# EAGLE design PICKIT4-adaptor-SWDOnly (EAGLE 7.7.0)
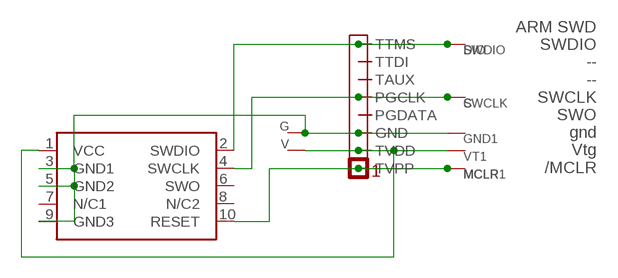
[diagram p0: schematic, sheet 1]

## Parts
C  WIRE-R12  [VIA12]
DIO  WIRE-R12  [VIA12]
G  WIRE-R12  [VIA12]
GND1  WIRE-R12  [VIA12]
MCLR  WIRE-R12  [VIA12]
MCLR1  WIRE-R12  [VIA12]
SWCLK  WIRE-R12  [VIA12]
SWD1  CORTEX_SWD  [M50-3600542]
SWDIO  WIRE-R12  [VIA12]
U$1  PICKIT4PINHDR  [PINHEAD1X8]
V  WIRE-R12  [VIA12]
VT1  WIRE-R12  [VIA12]

## Nets
GND: G.P$1 GND1.P$1 SWD1.3(GND1) SWD1.5(GND2) SWD1.9(GND3) U$1.P$3(GND)
N$2: SWD1.1(VCC) U$1.P$2(TVDD) V.P$1 VT1.P$1
N$5: C.P$1 SWCLK.P$1 SWD1.4(SWCLK) U$1.P$5(PGCLK)
N$9: MCLR1.P$1 MCLR.P$1 SWD1.10(RESET) U$1.P$1(TVPP)
TTMS: DIO.P$1 SWD1.2(SWDIO) SWDIO.P$1 U$1.P$8(TTMS)
Unconnected: SWD1.6(SWO) SWD1.7(N/C1) SWD1.8(N/C2) U$1.P$4(PGDATA) U$1.P$6(TAUX) U$1.P$7(TTDI)

## Library data of the parts
C DIO G GND1 MCLR MCLR1 SWCLK SWDIO V VT1 = mylib4:WIRE: Pad for a wire offboard
SWD1 = carrilib:CORTEX_SWD: .05" Cortex M Connector in SWD mode Manufacturer: Generic Part Number: Cortex M SWD Notes: I use Harwin M50-3600542 connectors
U$1 = mylib4:PICKIT4: PICKIT 4 Programming connector Handles PICx, ARM SWD, AVR ISP, UPDI, PDI, TPI, an JTAG/EJTAG

## Net classes
0 default: width 0.4 mm, drill 0.6 mm, clearance 0.152 mm
1 power: width 0.8 mm, drill 0.7 mm, clearance 0.152 mm
2 clock: width 0.25 mm, drill 0.6 mm, clearance 0.152 mm

## Board
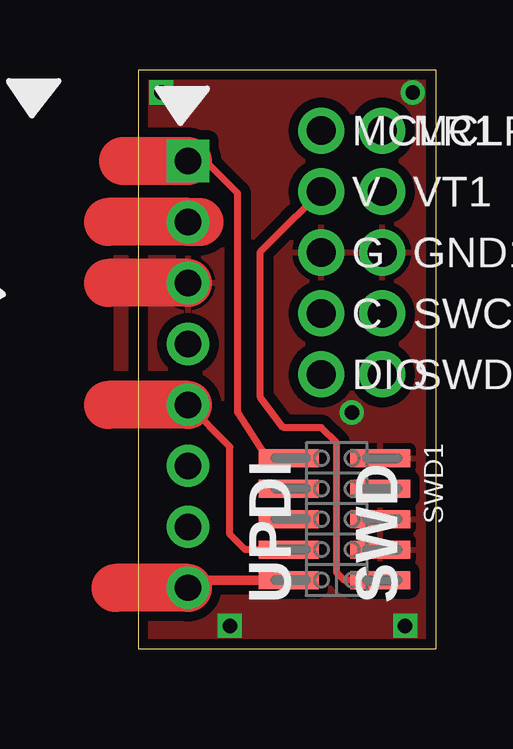
[diagram p1: board, top side]
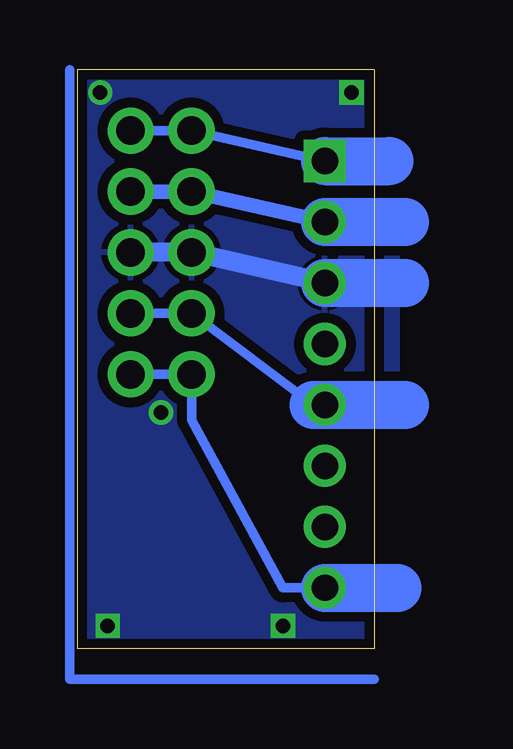
[diagram p2: board, bottom side, seen from below]

Size 12.38 x 24.13 mm. Coordinates in mm from the lower left corner, seen from the top.
Outline: 0,0 12.38,0 12.38,24.13 0,24.13 0,0
Copper layers (1*16): Top 0.035mm / dielectric 1.5mm / Bottom 0.035mm
Design rules "default *": minimum track width 10mil, minimum drill 24mil, track to track 6mil, track to pad 6mil, pad to pad 8mil, via to via 8mil, smd to smd 8mil, copper to edge 16mil, drill to drill 8mil, minimum pad ring 10mil, minimum via ring 8mil, stop-mask expansion 4mil, vias tented up to drill 0.65mm, thermal gap 10mil

### Footprints (pad centres in the part's own frame; a part is rotated, then mirrored left to right if it is on the bottom)
VIA12 = drill 1.2: P$1 0,0
M50-3600542 = smd 0.75 x 2.5: 1 -2.54,-1.81; 2 -2.54,2; 3 -1.27,-1.81; 4 -1.27,2; 5 0,-1.81; 6 0,2; 7 1.27,-1.81; 8 1.27,2; 9 2.54,-1.81; 10 2.54,2
PINHEAD1X8 = drill 1.1 square: P$1 0,8.89 | drill 1.1: P$2 0,6.35; P$3 0,3.81; P$4 0,1.27; P$5 0,-1.27; P$6 0,-3.81; P$7 0,-6.35; P$8 0,-8.89

### Placement (x,y rotation side)
C  7.62,13.97 0 top
DIO  7.62,11.43 0 top
G  7.62,16.51 0 top
GND1  10.16,16.51 0 top
MCLR  10.16,21.59 0 top
MCLR1  7.62,21.59 0 top
SWCLK  10.16,13.97 0 top
SWD1  8.26,5.4 90 top
SWDIO  10.16,11.43 0 top
U$1  2.06,11.43 0 top
V  7.62,19.05 0 top
VT1  10.16,19.05 0 top

### Tracks (layer width: path | path; a pad name or v marks a point on that pad's centre or on a via)
GND  (via drill 0.6)
  Top 2: U$1.P$3 -1.27,15.24
  Bottom 0.8: U$1.P$3 G.P$1 GND1.P$1
  Bottom 2: U$1.P$3 -1.27,15.24
  other vias: 0.95,23.18 11.43,23.18 11.11,0.95 3.81,0.95 8.89,9.84
  pour Top (isolate 0.4): -0.95,24.77 -0.95,-2.22 13.02,-2.22 13.02,24.77
  pour Bottom (isolate 0.4): -0.95,25.16 -0.95,-1.91 12.78,-1.98 12.78,25.32
N$1
  Bottom 0.4: 0,-1.27 12.7,-1.27 12.7,24.13
N$2
  Top 0.3: SWD1.1 8.57,2.86 8.26,3.18 8.26,8.57 7.62,9.21 6.03,9.21 5.08,10.48 5.08,16.54 6.34,17.81 7.33,18.76 V.P$1
  Top 2: 2.54,17.78 U$1.P$2 -1.27,17.78
  Bottom 0.6: U$1.P$2 V.P$1 VT1.P$1
  Bottom 2: U$1.P$2 -1.27,17.78
N$5
  Top 0.3: SWD1.4 4.45,4.13 3.81,4.76 3.81,8.41 U$1.P$5
  Top 2: U$1.P$5 -1.27,10.16
  Bottom 0.4: U$1.P$5 2.54,10.16 C.P$1 SWCLK.P$1
  Bottom 2: 2.54,10.16 -1.27,10.16
N$9
  Top 0.3: SWD1.10 5.3,8.03 4.13,9.84 4.13,18.98 2.65,20.46 2.2,20.46 U$1.P$1
  Top 2: U$1.P$1 -0.64,20.32
  Bottom 0.4: U$1.P$1 MCLR1.P$1 MCLR.P$1
  Bottom 2: U$1.P$1 -0.64,20.32
TTMS
  Top 0.4: SWD1.2 2.38,2.86 U$1.P$8
  Top 2: U$1.P$8 -0.95,2.54
  Bottom 0.4: U$1.P$8 3.81,2.54 7.62,9.53 DIO.P$1 SWDIO.P$1
  Bottom 2: U$1.P$8 -0.95,2.54

### Text on the board
tPlace: UPDI | SWD
_tSilk: MCLR | V | G | D | C | PICKit4/SNAP | DIO | UPDI | SWD
_bplace: MCLR | V | G | D | C | PICKit4 or SNAP | DIO | UPDI | SWD